# EAGLE design eeZee_big_tiny (EAGLE 6.3)
DATABASE: ./../../../EAGLE/PARTSDB.TXT
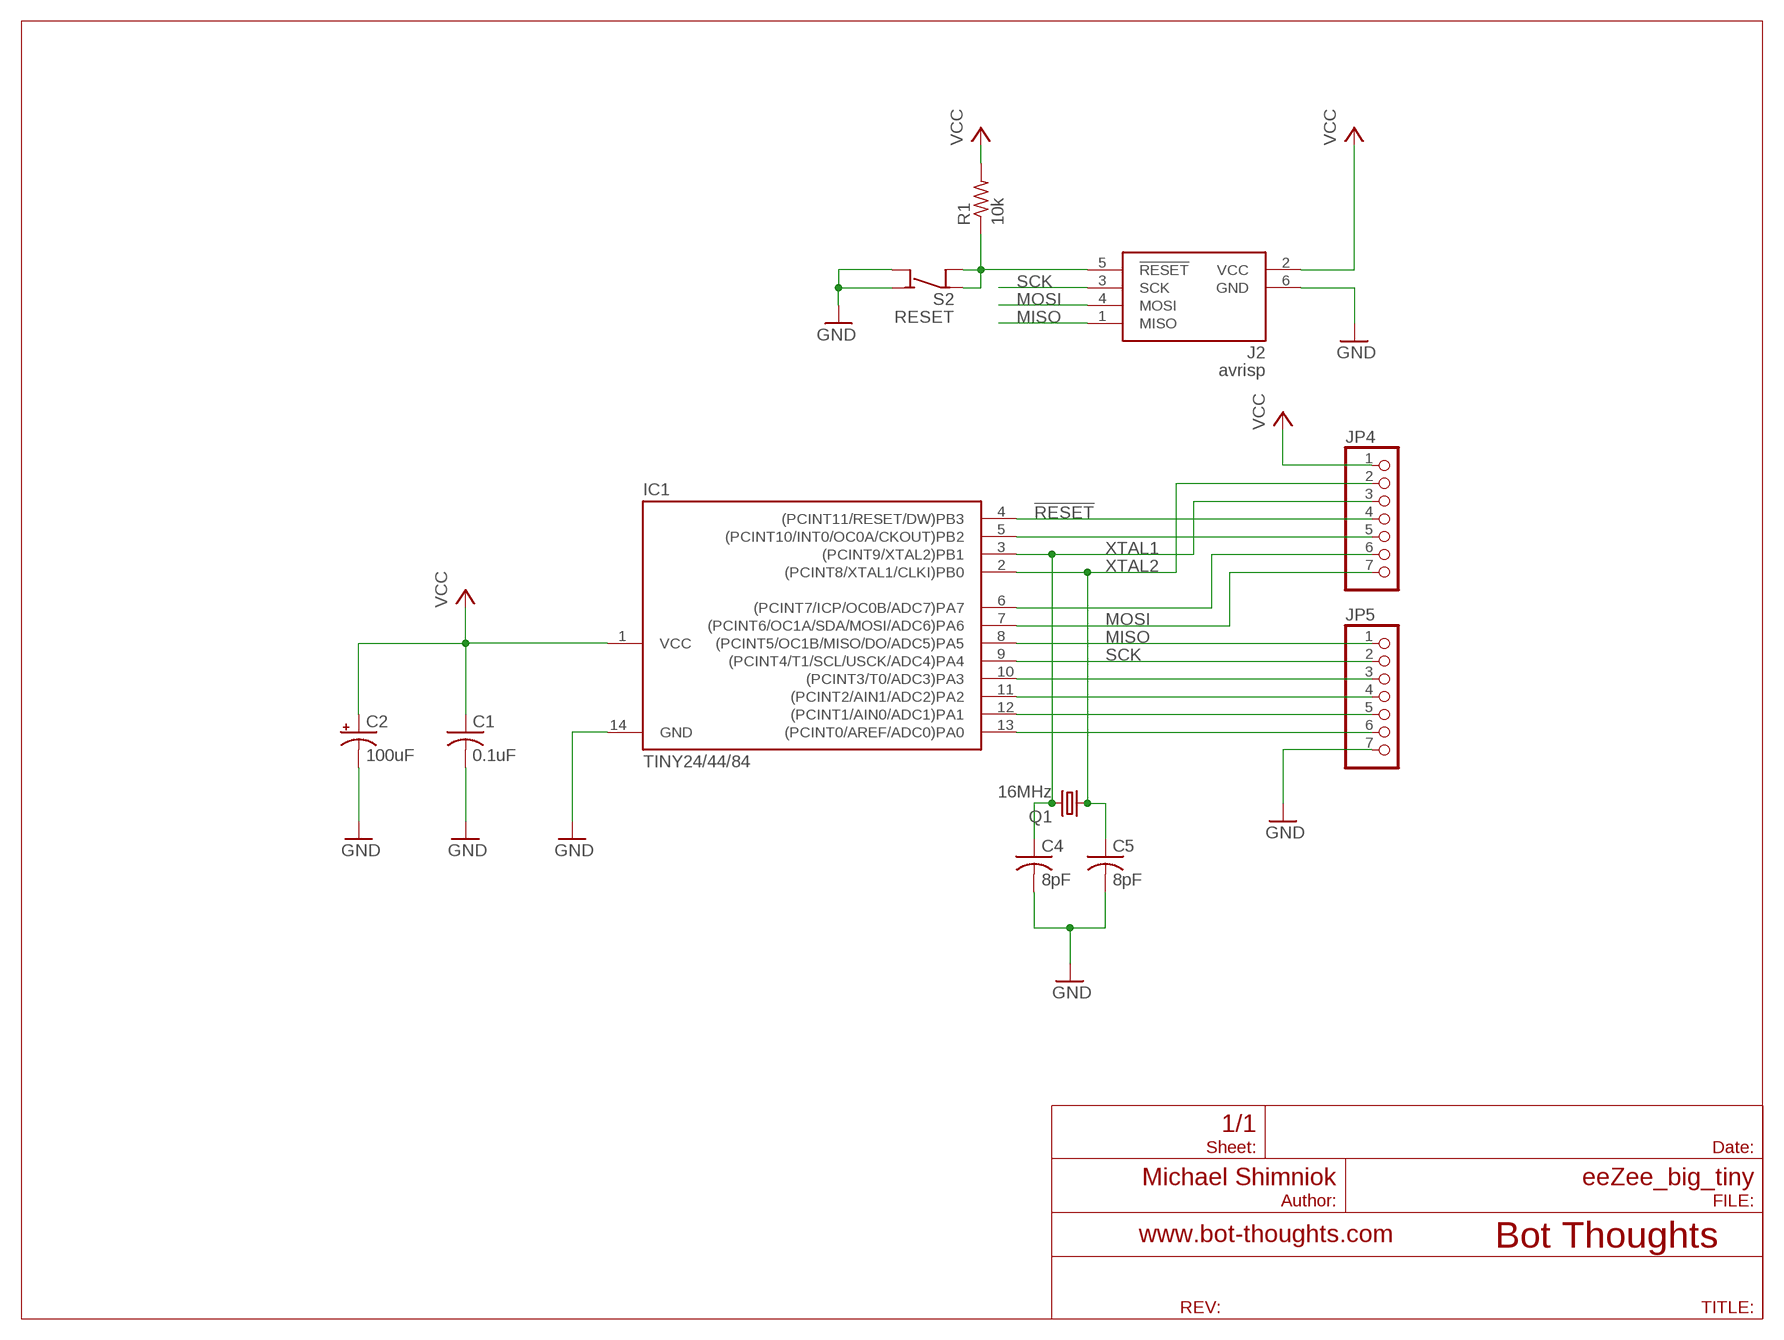
[diagram p0: schematic, sheet 1]

## Parts
C1  0.1uF  C-USC0603  [C0603]
C2  100uF  CPOL-USSMCB  [SMC_B]
C4  8pF  C-USC0603  [C0603]
C5  8pF  C-USC0603  [C0603]
IC1  TINY24/44/84  TINY24/44/84-PU  [DIL14]
J2  avrisp  AVRISP6  [CON6P2R]
JP4  PINHD-1X07_2.54-S  [1X07-S]
JP5  PINHD-1X07_2.54-S  [1X07-S]
Q1  16MHz  CRYSTALNDK5X3  [NDK_2PAD_5X3]
R1  10k  R-US_R0603  [R0603]
S2  RESET  SPST4  [6MMTACTILE_4PIN]

## Nets
!RESET: IC1.4((PCINT11/RESET/DW)PB3) J2.5(!RESET) JP4.4 R1.1 S2.B1(COM) S2.B2(COM)
GND: C1.2 C2.- C4.2 C5.2 IC1.14(GND) J2.6(GND) JP5.7 S2.A1(NO) S2.A2(NO)
MISO: IC1.8((PCINT5/OC1B/MISO/DO/ADC5)PA5) J2.1(MISO) JP5.1
MOSI: IC1.7((PCINT6/OC1A/SDA/MOSI/ADC6)PA6) J2.4(MOSI) JP4.7
N$1: IC1.5((PCINT10/INT0/OC0A/CKOUT)PB2) JP4.5
N$4: IC1.6((PCINT7/ICP/OC0B/ADC7)PA7) JP4.6
N$8: IC1.10((PCINT3/T0/ADC3)PA3) JP5.3
N$9: IC1.11((PCINT2/AIN1/ADC2)PA2) JP5.4
N$10: IC1.12((PCINT1/AIN0/ADC1)PA1) JP5.5
N$11: IC1.13((PCINT0/AREF/ADC0)PA0) JP5.6
SCK: IC1.9((PCINT4/T1/SCL/USCK/ADC4)PA4) J2.3(SCK) JP5.2
VCC: C1.1 C2.+ IC1.1(VCC) J2.2(VCC) JP4.1 R1.2
XTAL1: C5.1 IC1.2((PCINT8/XTAL1/CLKI)PB0) JP4.2 Q1.P$1
XTAL2: C4.1 IC1.3((PCINT9/XTAL2)PB1) JP4.3 Q1.P$2

## Library data of the parts
C1 C4 C5 = rcl:C-US: CAPACITOR, American symbol; BOM: EXCLUDE; PARTNO: 0603YC104KAT2A
C2 = rcl:CPOL-US: POLARIZED CAPACITOR, American symbol; BOM: EXCLUDE; PARTNO: MCTT21X106M6R3CT
IC1 = avr-7:TINY24/44/84
J2 = ads4:AVRISP6: 6-pin dual-row connector for Atmel AVRISP programmer interface
JP4 JP5 = pinhead-2:PINHD-1X07: PIN HEADER
Q1 = mes_crystal:CRYSTAL: CRYSTAL
R1 = rcl:R-US_: RESISTOR, American symbol; PARTNO: ERJ-3GEYJ103V
S2 = mes_electromech:SPST4: SPST switch with 2 pins per contact

## Board
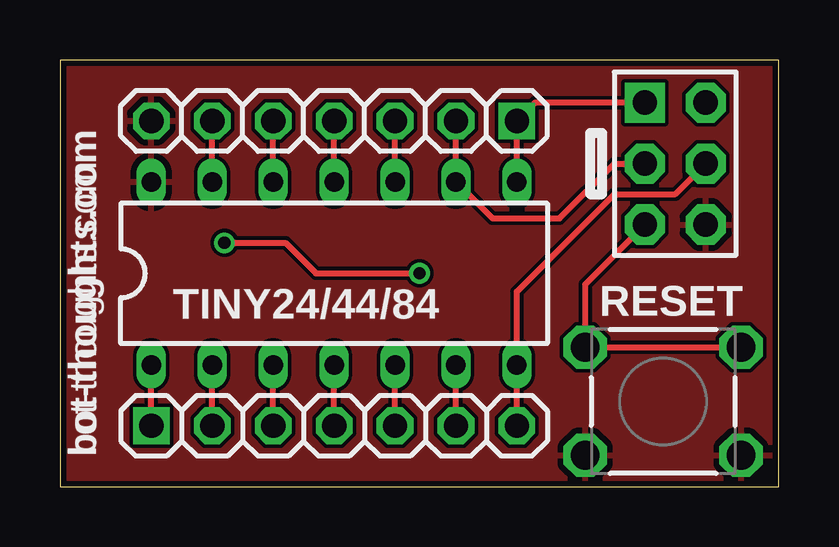
[diagram p1: board, top side]
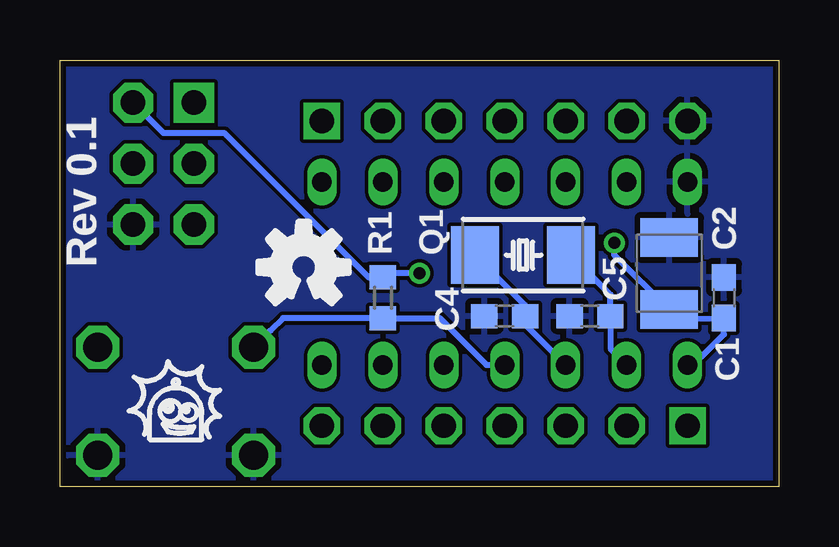
[diagram p2: board, bottom side, seen from below]

Size 29.97 x 17.78 mm. Coordinates in mm from the lower left corner, seen from the top.
Outline: 0,0 29.97,0 29.97,17.78 0,17.78 0,0
Copper layers (1*16): Top 0.0356mm / dielectric 1.5011mm / Bottom 0.0356mm
Design rules "default *": minimum track width 6mil, minimum drill 13mil, track to track 6mil, track to pad 6mil, pad to pad 6mil, via to via 6mil, smd to smd 6mil, copper to edge 10mil, drill to drill 6mil, minimum pad ring 7mil, minimum via ring 7mil, stop-mask expansion 4mil, vias tented up to drill 21mil, thermal gap 10mil

### Footprints (pad centres in the part's own frame; a part is rotated, then mirrored left to right if it is on the bottom)
C0603 = smd 1.1 x 1: 1 -0.85,0; 2 0.85,0
SMC_B = smd 1.6 x 2.4: + -1.5,0; - 1.5,0
DIL14 = drill 0.813 long: 1 -7.62,-3.81; 2 -5.08,-3.81; 3 -2.54,-3.81; 4 0,-3.81; 5 2.54,-3.81; 6 5.08,-3.81; 7 7.62,-3.81; 8 7.62,3.81; 9 5.08,3.81; 10 2.54,3.81; 11 0,3.81; 12 -2.54,3.81; 13 -5.08,3.81; 14 -7.62,3.81
CON6P2R = drill 1.016 pad 1.676 square: 1 -2.54,-1.27 | drill 1.016 pad 1.676 octagon: 2 -2.54,1.27; 3 0,-1.27; 4 0,1.27; 5 2.54,-1.27; 6 2.54,1.27
1X07-S = drill 1.016 square: 1 -7.62,0 | drill 1.016 octagon: 2 -5.08,0; 3 -2.54,0; 4 0,0; 5 2.54,0; 6 5.08,0; 7 7.62,0
NDK_2PAD_5X3 = smd 2 x 2.4: P$1 -2,0; P$2 2,0
R0603 = smd 1 x 1.1: 1 -0.85,0; 2 0.85,0
6MMTACTILE_4PIN = drill 1.2 octagon: A1 3.25,-2.25; A2 -3.25,-2.25; B1 3.25,2.25; B2 -3.25,2.25

### Placement (x,y rotation side)
C1  2.29,7.87 90 bottom
C2  4.57,8.89 90 bottom
C4  11.43,7.11 180 bottom
C5  7.87,7.11 180 bottom
IC1  11.43,8.89 0 top
J2  25.65,13.46 270 top
JP4  11.43,2.54 0 top
JP5  11.43,15.24 180 top
Q1  10.67,9.65 180 bottom
R1  16.51,7.87 90 bottom
S2  25.15,3.56 0 top

### Tracks (layer width: path | path; a pad name or v marks a point on that pad's centre or on a via)
!RESET
  Top 0.254: JP4.4 IC1.4 | S2.B1 S2.B2 21.9,8.43 J2.5
  Bottom 0.254: S2.B2 21.47,6.23 21.19,6.52 20.68,7.02 R1.1 14.14,7.02 12.19,5.08 IC1.4
GND
  pour Bottom: 0,17.78 29.97,17.78 29.97,0 0,0
  pour Top: 0,17.78 29.97,17.78 29.97,0 0,0
MISO
  Top 0.254: IC1.8 JP5.1 19.81,16 J2.1
MOSI
  Top 0.254: JP4.7 IC1.7 19.05,8.13 23.11,12.19 25.65,12.19 J2.4
N$1
  Top 0.254: JP4.5 IC1.5
N$4
  Top 0.254: JP4.6 IC1.6
N$8
  Top 0.254: IC1.10 JP5.3
N$9
  Top 0.254: IC1.11 JP5.4
N$10
  Top 0.254: IC1.12 JP5.5
N$11
  Top 0.254: IC1.13 JP5.6
SCK
  Top 0.254: JP5.2 IC1.9 18.03,11.18 20.83,11.18 23.11,13.46 J2.3
VCC  (via drill 0.51)
  Top 0.254: JP4.1 IC1.1 | v6.86,10.16 9.4,10.16 10.67,8.89 v14.99,8.89
  Bottom 0.254: IC1.1 3.56,5.08 2.29,6.35 C1.1 4.18,7.01 C2.+ 4.6,7.39 6.86,9.65 v6.86,10.16 | J2.2 25.65,14.73 23.11,14.73 17.11,8.72 R1.2 16.34,8.89 v14.99,8.89
XTAL1
  Top 0.254: JP4.2 IC1.2
  Bottom 0.254: Q1.P$1 7.02,8.01 C5.1 7.02,5.75 IC1.2
XTAL2
  Top 0.254: JP4.3 IC1.3
  Bottom 0.254: IC1.3 10.58,6.77 C4.1 10.58,7.56 Q1.P$2

### Text on the board
tNames: bot-thoughts.com
bNames: Rev 0.1
tsilk: TINY24/44/84 | RESET | bot-thoughts.com
bsilk: C2 | Q1 | R1 | Rev 0.1 | C5 | C1 | C4